# EAGLE design L293_crnaked (EAGLE 5.08)
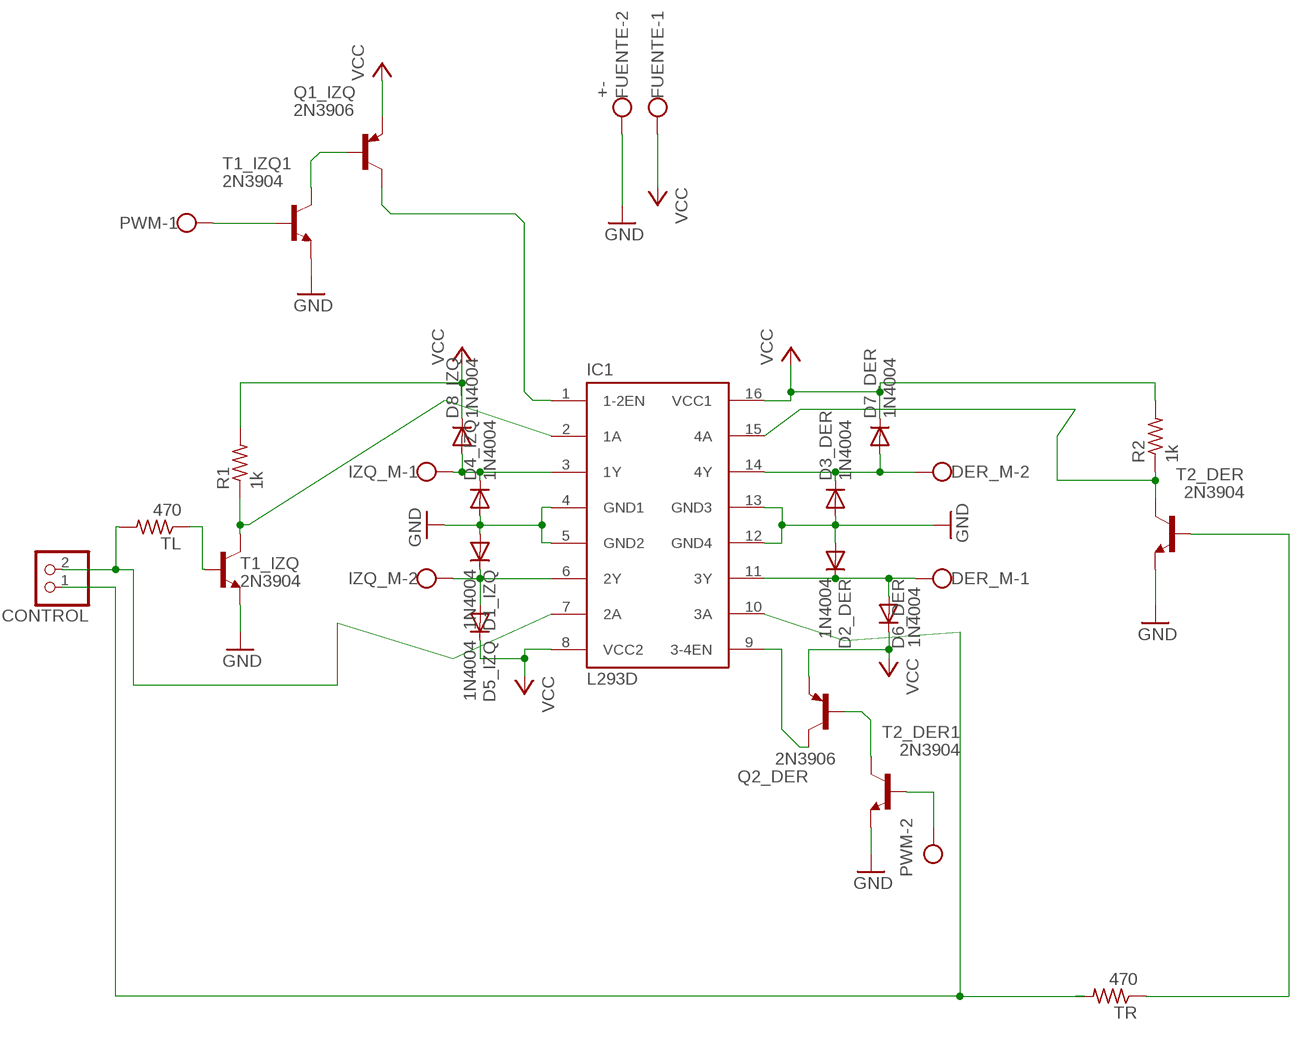
[diagram p0: schematic, sheet 1]

## Parts
CONTROL  PINHD-1X2/90  [1X02/90]
D1_IZQ  1N4004  [DO41-10]
D2_DER  1N4004  [DO41-10]
D3_DER  1N4004  [DO41-10]
D4_IZQ  1N4004  [DO41-10]
D5_IZQ  1N4004  [DO41-10]
D6_DER  1N4004  [DO41-10]
D7_DER  1N4004  [DO41-10]
D8_IZQ  1N4004  [DO41-10]
DER_M  W237-02P  [W237-132]
FUENTE  +-  W237-02P  [W237-132]
IC1  L293D  [DIL16]
IZQ_M  W237-02P  [W237-132]
PWM  W237-02P  [W237-132]
Q1_IZQ  2N3906  [TO92]
Q2_DER  2N3906  [TO92]
R1  1k  R-US_0207/12  [0207/12]
R2  1k  R-US_0207/12  [0207/12]
T1_IZQ  2N3904  [TO92]
T1_IZQ1  2N3904  [TO92]
T2_DER  2N3904  [TO92]
T2_DER1  2N3904  [TO92]
TL  470  R-US_0207/12  [0207/12]
TR  470  R-US_0207/12  [0207/12]

## Nets
GND: D1_IZQ.A D2_DER.A D3_DER.A D4_IZQ.A FUENTE.2 IC1.4(GND1) IC1.5(GND2) IC1.12(GND4) IC1.13(GND3) T1_IZQ1.3(E) T1_IZQ.3(E) T2_DER1.3(E) T2_DER.3(E)
N$1: D2_DER.C D6_DER.A DER_M.1 IC1.11(3Y)
N$2: D3_DER.C D7_DER.A DER_M.2 IC1.14(4Y)
N$3: D1_IZQ.C D5_IZQ.A IC1.6(2Y) IZQ_M.2
N$4: D4_IZQ.C D8_IZQ.A IC1.3(1Y) IZQ_M.1
N$5: CONTROL.2 IC1.7(2A) TL.2
N$6: T1_IZQ.2(B) TL.1
N$7: IC1.2(1A) R1.1 T1_IZQ.1(C)
N$8: T2_DER.2(B) TR.1
N$9: IC1.15(4A) R2.1 T2_DER.1(C)
N$10: Q1_IZQ.2(B) T1_IZQ1.1(C)
N$11: IC1.1(1-2EN) Q1_IZQ.1(C)
N$12: CONTROL.1 IC1.10(3A) TR.2
N$13: PWM.1 T1_IZQ1.2(B)
N$14: Q2_DER.2(B) T2_DER1.1(C)
N$15: PWM.2 T2_DER1.2(B)
N$17: IC1.9(3-4EN) Q2_DER.1(C)
VCC: D5_IZQ.C D6_DER.C D7_DER.C D8_IZQ.C FUENTE.1 IC1.8(VCC2) IC1.16(VCC1) Q1_IZQ.3(E) Q2_DER.3(E) R1.2 R2.2

## Library data of the parts
CONTROL = pinhead:PINHD-1X2: PIN HEADER
D1_IZQ D2_DER D3_DER D4_IZQ D5_IZQ D6_DER D7_DER D8_IZQ = diode:1N4004: DIODE general purpose rectifier, 1 A
DER_M FUENTE IZQ_M PWM = con-wago-508:W237-02P: WAGO SREW CLAMP
IC1 = st-microelectronics:L293D: PUSH-PULL 4 CHANNEL DRIVER
Q1_IZQ Q2_DER = transistor-pnp:2N3906: PNP Transistor
R1 R2 TL TR = rcl:R-US_: RESISTOR, American symbol
T1_IZQ T1_IZQ1 T2_DER T2_DER1 = transistor:2N3904: NPN TRANSISTOR

## Board
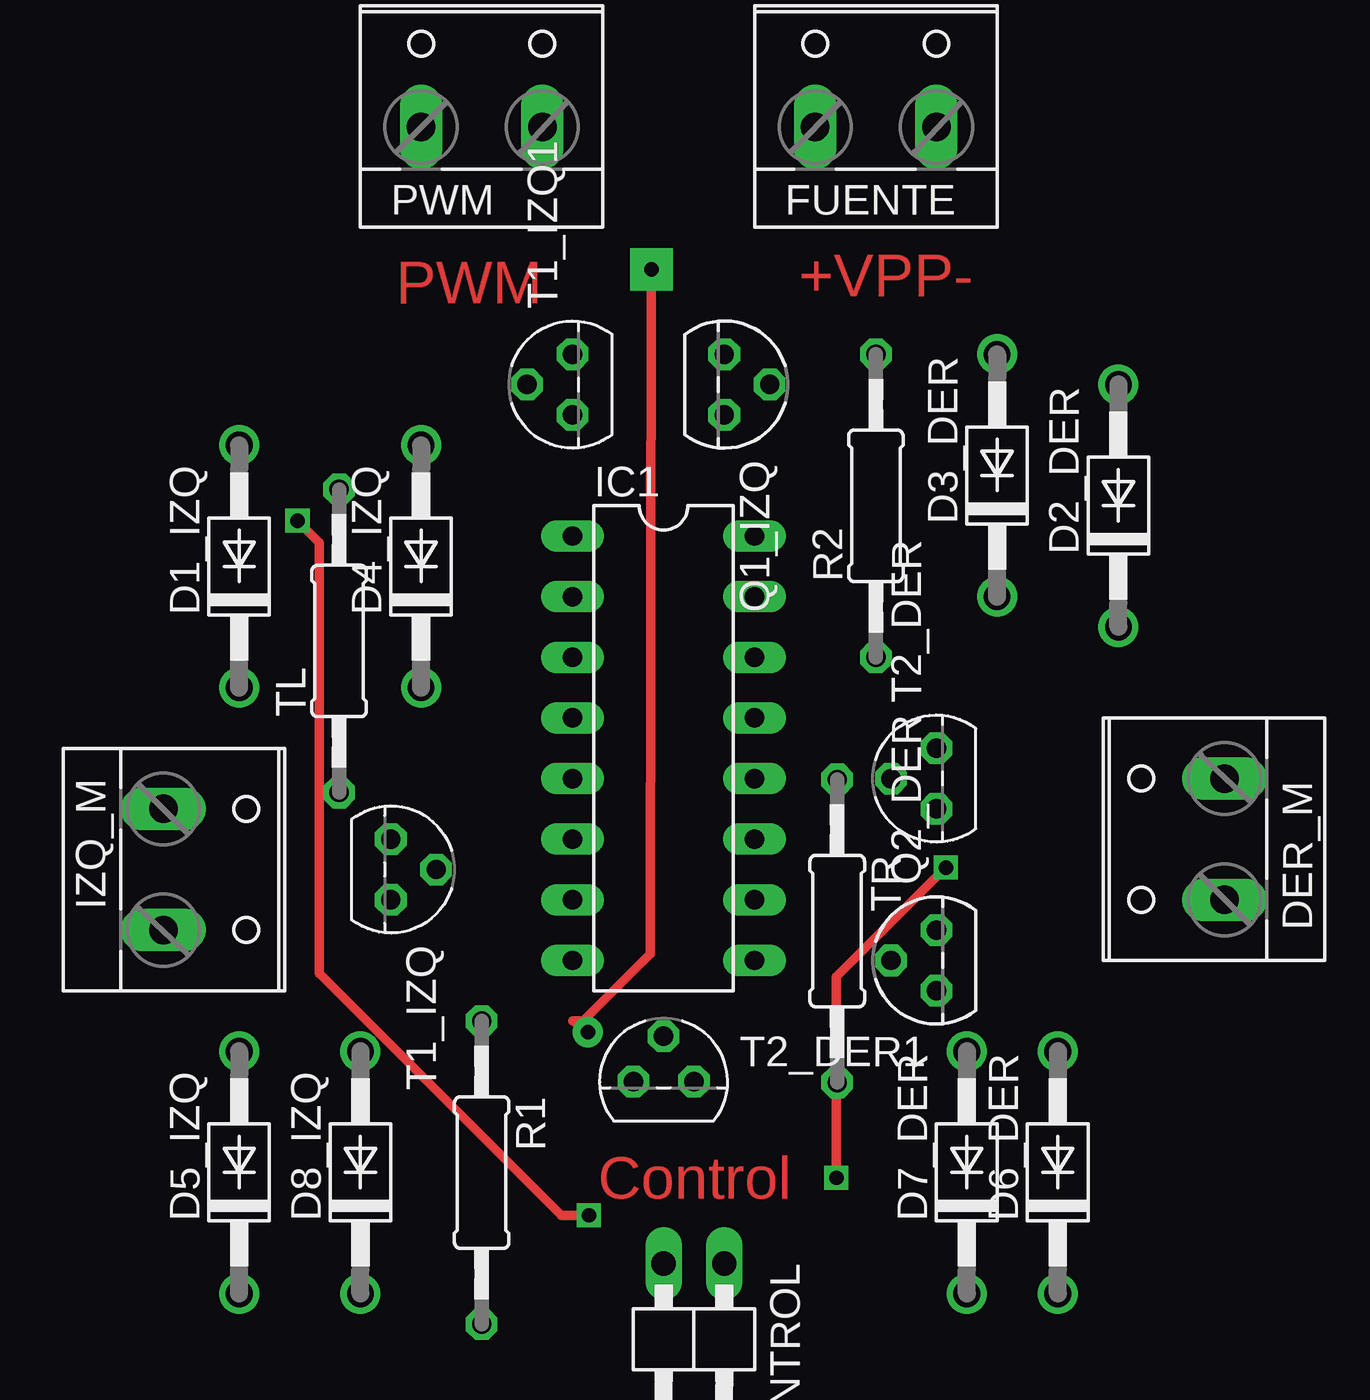
[diagram p1: board, top side]
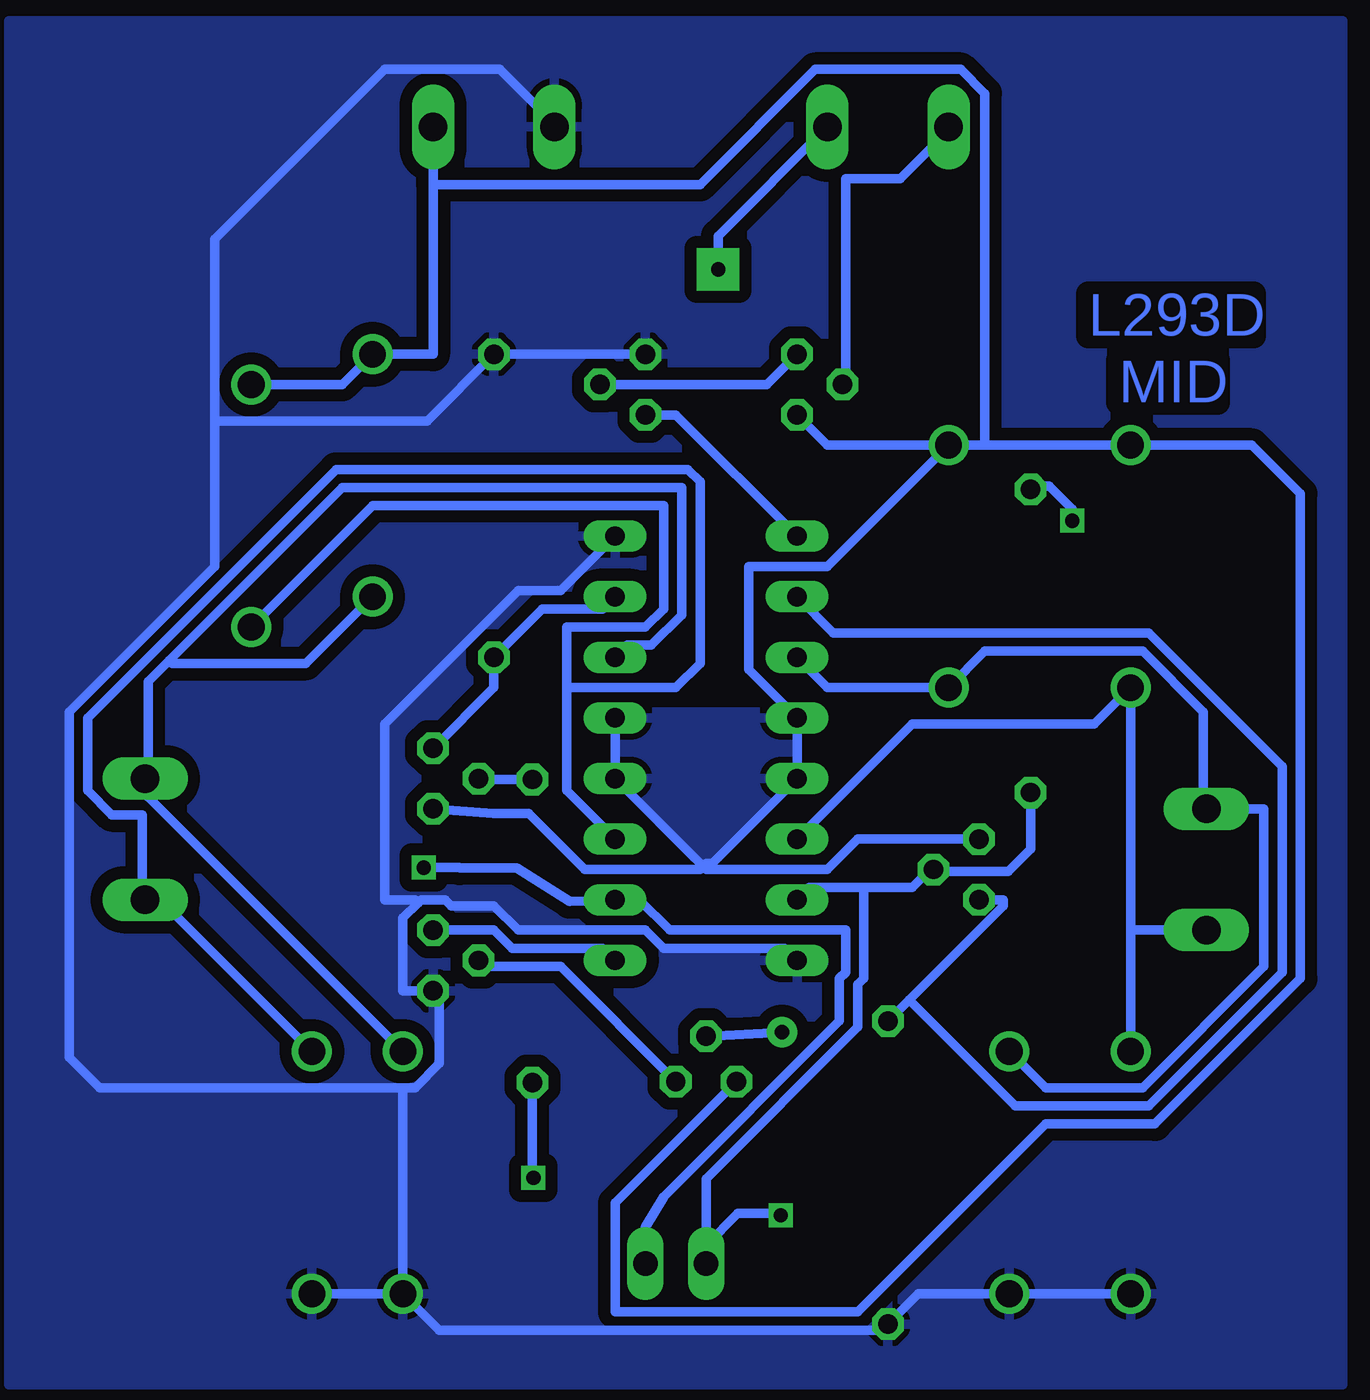
[diagram p2: board, bottom side, seen from below]

No outline drawn. Coordinates in mm, seen from the top.
Copper layers (1*16): Top 0.035mm / dielectric 1.5mm / Bottom 0.035mm
Design rules: minimum track width 16mil, minimum drill 24mil, track to track 20mil, track to pad 20mil, pad to pad 20mil, via to via 20mil, smd to smd 8mil, copper to edge 40mil, drill to drill 8mil, minimum pad ring 10mil, minimum via ring 8mil, stop-mask expansion 4mil, vias tented up to drill 0mil, thermal gap 10mil

### Footprints (pad centres in the part's own frame; a part is rotated, then mirrored left to right if it is on the bottom)
1X02/90 = drill 1.016 long: 1 -1.27,-3.81; 2 1.27,-3.81
DO41-10 = drill 1.118: A 5.08,0; C -5.08,0
W237-132 = drill 1.194 long: 1 -2.54,-0.635; 2 2.54,-0.635
DIL16 = drill 0.813 long: 1 -8.89,-3.81; 2 -6.35,-3.81; 3 -3.81,-3.81; 4 -1.27,-3.81; 5 1.27,-3.81; 6 3.81,-3.81; 7 6.35,-3.81; 8 8.89,-3.81; 9 8.89,3.81; 10 6.35,3.81; 11 3.81,3.81; 12 1.27,3.81; 13 -1.27,3.81; 14 -3.81,3.81; 15 -6.35,3.81; 16 -8.89,3.81
TO92 = drill 0.813 octagon: 1 1.27,0; 2 0,1.905; 3 -1.27,0
0207/12 = drill 0.813 octagon: 1 -6.35,0; 2 6.35,0

### Placement (x,y rotation side)
CONTROL  45.72,3.81 180 top
D1_IZQ  26.67,36.83 90 top
D2_DER  63.5,39.37 90 top
D3_DER  58.42,40.64 90 top
D4_IZQ  34.29,36.83 90 top
D5_IZQ  26.67,11.43 90 top
D6_DER  60.96,11.43 90 top
D7_DER  57.15,11.43 90 top
D8_IZQ  31.75,11.43 90 top
DER_M  67.31,25.4 90 top
FUENTE  53.34,55.88 0 top
IC1  44.45,29.21 270 top
IZQ_M  24.13,24.13 270 top
PWM  36.83,55.88 0 top
Q1_IZQ  46.99,44.45 270 top
Q2_DER  55.88,20.32 90 top
R1  36.83,11.43 270 top
R2  53.34,39.37 90 top
T1_IZQ  33.02,24.13 270 top
T1_IZQ1  40.64,44.45 90 top
T2_DER  55.88,27.94 90 top
T2_DER1  44.45,15.24 0 top
TL  30.86,33.71 90 top
TR  51.72,21.55 270 top

### Tracks (layer width: path | path; a pad name or v marks a point on that pad's centre or on a via)
GND
  Bottom 0.406: T1_IZQ.3 38.1,25.4 39.37,24.13 44.45,24.13 44.58,24.26 | 44.58,24.26 IC1.12 IC1.13 | T2_DER.3 53.37,26.47 51.87,26.47 49.53,24.13 44.7,24.13 44.58,24.26 | 44.58,24.26 44.45,24.38 44.2,24.38 IC1.5 IC1.4 42.67,32.51 42.67,36.83 39.37,36.83 D4_IZQ.A | D2_DER.A 59.69,44.45 D3_DER.A 55.88,45.72 55.88,52.83 | 55.88,52.83 FUENTE.2 | T1_IZQ1.3 39.37,41.91 D4_IZQ.A | T2_DER1.3 48.26,10.16 48.26,5.59 38.1,5.59 30.23,13.46 25.65,13.46 19.56,19.56 19.56,39.88 21.59,41.91 D1_IZQ.A 32.77,41.91 | 32.77,41.91 D4_IZQ.A | 55.88,52.83 44.7,52.83 39.88,57.66 33.78,57.66 32.77,56.64 32.77,41.91
  pour Bottom: 40.39,30.73 48.26,30.73 48.26,30.23 48.26,27.69 48.01,27.69 44.96,24.64 43.94,24.64 41.15,27.43 40.64,27.94 40.64,30.23 40.13,30.73
N$1
  Bottom 0.406: D6_DER.A 67.31,22.86 DER_M.1 68.07,22.86 68.07,26.42 69.34,26.42 70.36,27.43 70.36,30.48 59.94,40.89 45.21,40.89 44.7,40.39 44.7,32.77 45.72,31.75 50.29,31.75 | IC1.11 50.29,27.43 50.29,31.75 | 50.29,31.75 50.29,34.29 46.99,34.29 46.23,35.05 46.23,39.37 58.42,39.37 D2_DER.C
N$2
  Bottom 0.406: IC1.14 47.75,33.53 46.74,33.53 45.47,34.8 45.47,40.13 59.69,40.13 66.93,32.89 | 66.93,32.89 67.82,32 67.82,27.94 | D7_DER.A 67.82,27.18 67.82,27.94 | 67.82,27.94 DER_M.2 | D3_DER.C 61.21,32.77 66.8,32.77 66.93,32.89
N$3
  Bottom 0.406: D5_IZQ.A 26.67,21.59 | 26.67,21.59 IZQ_M.2 | IC1.6 35.81,30.23 28.19,30.23 D1_IZQ.C 26.67,21.59
N$4
  Bottom 0.406: IC1.3 39.37,31.75 D4_IZQ.C 32.77,33.27 26.16,33.27 23.62,30.73 23.62,26.67 IZQ_M.1 21.08,26.67 21.08,20.07 26.16,14.99 30.23,14.99 D8_IZQ.A
N$5  (via drill 0.6)
  Top 0.406: v41.32,9.64 40.17,9.64 30.02,19.78 30.02,37.83 v29.11,38.74
  Bottom 0.406: IC1.7 40.13,23.37 37.85,23.37 | 37.85,23.37 35.81,23.37 35.05,24.13 | 37.85,23.37 37.85,19.56 38.1,19.3 38.1,17.53 44.45,11.18 CONTROL.2 44.45,8.38 43.12,9.71 41.4,9.71 v41.32,9.64 | v29.11,38.74 29.11,39.24 30.07,40.2 30.72,40.2 TL.2
N$6
  Bottom 0.406: TL.1 30.86,24.99 31.79,24.05 34.85,24.05 T1_IZQ.2
N$7
  Bottom 0.406: 35.94,18.67 32,22.61 32,22.86 T1_IZQ.1 | 35.94,18.67 R1.1 | IC1.2 39.12,34.04 25.91,34.04 20.32,28.45 20.32,19.81 25.91,14.22 31.5,14.22 35.94,18.67
N$8
  Bottom 0.406: TR.1 53.98,27.9 T2_DER.2
N$9
  Bottom 0.406: IC1.15 48.77,35.05 51.31,35.05 R2.1 53.34,31.75 T2_DER.1
N$10
  Bottom 0.406: T1_IZQ1.1 41.91,44.45 Q1_IZQ.2
N$11
  Bottom 0.406: IC1.1 45.72,43.18 Q1_IZQ.1
N$12  (via drill 0.6)
  Top 0.406: v51.69,11.21 51.69,19.62 v56.28,24.21
  Bottom 0.406: CONTROL.1 46.99,9.14 46.23,10.41 38.86,17.78 38.86,19.56 38.61,19.81 38.61,21.59 45.97,21.59 47.24,22.86 IC1.10 50.17,22.79 52.38,24.19 54.77,24.19 54.78,24.21 v56.28,24.21 | TR.2 51.72,11.24 v51.69,11.21
N$13
  Bottom 0.406: T1_IZQ1.2 38.61,44.45 38.61,53.09 36.32,53.09 34.29,55.12 PWM.1
N$14
  Bottom 0.406: T2_DER1.1 50.55,20.07 53.59,20.07 53.85,20.32 Q2_DER.2
N$15  (via drill 0.6 pad 1.27, 0.6 pad 1.78)
  Top 0.406: v41.28,17.31 40.64,17.78 41.08,17.78 43.89,20.59 v43.94,49.28
  Bottom 0.406: v41.28,17.31 T2_DER1.2 | v43.94,49.28 43.94,50.67 PWM.2
N$17
  Bottom 0.406: IC1.9 48.77,20.83 52.58,20.83 53.34,21.59 Q2_DER.1
VCC
  Bottom 0.406: Q1_IZQ.3 R2.2 56.13,42.93 65.02,42.93 | 65.02,42.93 65.02,50.55 57.91,57.66 53.09,57.66 50.8,55.37 FUENTE.1 | D5_IZQ.C D8_IZQ.C 35.56,6.35 R1.2 37.08,4.83 55.63,4.83 D7_DER.C | D7_DER.C D6_DER.C | IC1.8 41.15,20.83 46.23,20.83 46.99,21.59 52.32,21.59 53.34,22.61 55.12,22.61 55.37,22.86 56.39,22.86 56.52,22.73 | 56.52,22.73 57.15,22.1 57.15,19.05 Q2_DER.3 55.63,19.05 55.63,16 56.64,14.99 57.15,14.99 | IC1.16 50.55,35.81 52.32,35.81 57.91,30.23 57.91,22.86 56.64,22.86 56.52,22.73 | D7_DER.C 57.15,14.99 | 65.02,42.93 65.02,36.83 71.12,30.73 71.12,16.26 69.85,14.99 57.15,14.99
  pour Bottom: 17.78,2.54 17.78,59.69 73.66,59.69 73.66,2.54

### Text on the board
Top: PWM | +VPP- | Control
Bottom: L293D | MID